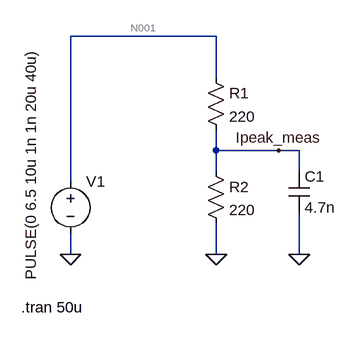
[diagram p0: schematic Ipeak_cond.asc]
Ipeak_cond.asc, the LTspice schematic file:
Version 4
SHEET 1 880 680
WIRE 224 -80 0 -80
WIRE 224 -16 224 -80
WIRE 224 96 224 64
WIRE 320 96 224 96
WIRE 352 96 320 96
WIRE 224 128 224 96
WIRE 352 128 352 96
WIRE 0 144 0 -80
WIRE 0 256 0 224
WIRE 224 256 224 208
WIRE 352 256 352 192
FLAG 0 256 0
FLAG 224 256 0
FLAG 352 256 0
FLAG 320 96 Ipeak_meas
SYMBOL voltage 0 128 R0
WINDOW 3 -61 -190 VRight 2
WINDOW 123 0 0 Left 0
WINDOW 39 0 0 Left 0
SYMATTR InstName V1
SYMATTR Value PULSE(0 6.5 10u 1n 1n 20u 40u)
SYMBOL res 208 -32 R0
SYMATTR InstName R1
SYMATTR Value 220
SYMBOL res 208 112 R0
SYMATTR InstName R2
SYMATTR Value 220
SYMBOL cap 336 128 R0
SYMATTR InstName C1
SYMATTR Value 4.7n
TEXT -76 338 Left 2 !.tran 50u

The netlist it stands for:
* Ipeak_cond.asc
V1 N001 0 PULSE(0 6.5 10u 1n 1n 20u 40u)
R1 N001 Ipeak_meas 220
R2 Ipeak_meas 0 220
C1 Ipeak_meas 0 4.7n
.tran 50u
.backanno
.end

* Results of the author's LTspice run, read from the files saved beside the schematic
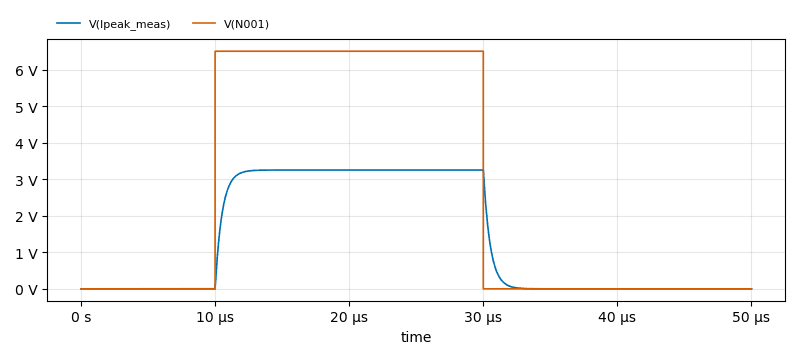
[diagram p1: Transient Analysis of Ipeak_cond.asc, plotted from the saved traces]
* Transient Analysis, 1 run:
*   V(Ipeak_meas): min 0 V, max 3.25 V, average 1.3 V, rms 2.029 V, last 0 V
*   V(N001): min 0 V, max 6.5 V, average 2.6 V, rms 4.111 V, last 0 V